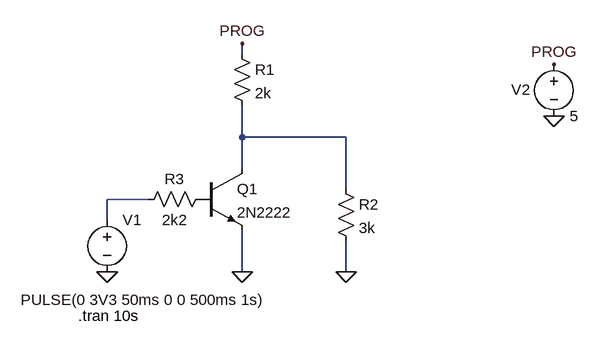
[diagram p0: schematic fast_charge.asc]
fast_charge.asc, the LTspice schematic file:
Version 4
SHEET 1 880 680
WIRE 224 -80 224 -96
WIRE 224 48 224 0
WIRE 384 48 224 48
WIRE 224 96 224 48
WIRE 384 128 384 48
WIRE 80 144 16 144
WIRE 16 176 16 144
WIRE 224 256 224 192
WIRE 384 256 384 208
FLAG 224 256 0
FLAG 384 256 0
FLAG 16 256 0
FLAG 704 16 0
FLAG 704 -64 PROG
FLAG 224 -96 PROG
SYMBOL npn 160 96 R0
SYMATTR InstName Q1
SYMATTR Value 2N2222
SYMBOL res 208 -96 R0
SYMATTR InstName R1
SYMATTR Value 2k
SYMBOL res 368 112 R0
SYMATTR InstName R2
SYMATTR Value 3k
SYMBOL res 176 128 R90
WINDOW 0 0 56 VBottom 2
WINDOW 3 32 56 VTop 2
SYMATTR InstName R3
SYMATTR Value 2k2
SYMBOL voltage 16 160 R0
WINDOW 3 -133 139 Left 2
WINDOW 123 0 0 Left 0
WINDOW 39 0 0 Left 0
SYMATTR InstName V1
SYMATTR Value PULSE(0 3V3 50ms 0 0 500ms 1s)
SYMBOL voltage 704 -80 R0
WINDOW 0 -66 55 Left 2
WINDOW 123 0 0 Left 0
WINDOW 39 0 0 Left 0
SYMATTR InstName V2
SYMATTR Value 5
TEXT -29 323 Left 2 !.tran 10s

The netlist it stands for:
* fast_charge.asc
Q1 N001 P001 0 0 2N2222
R1 PROG N001 2k
R2 N001 0 3k
R3 P001 N002 2k2
V1 N002 0 PULSE(0 3V3 50ms 0 0 500ms 1s)
V2 PROG 0 5
.model NPN NPN
.model PNP PNP
.lib standard.bjt
.tran 10s
.backanno
.end